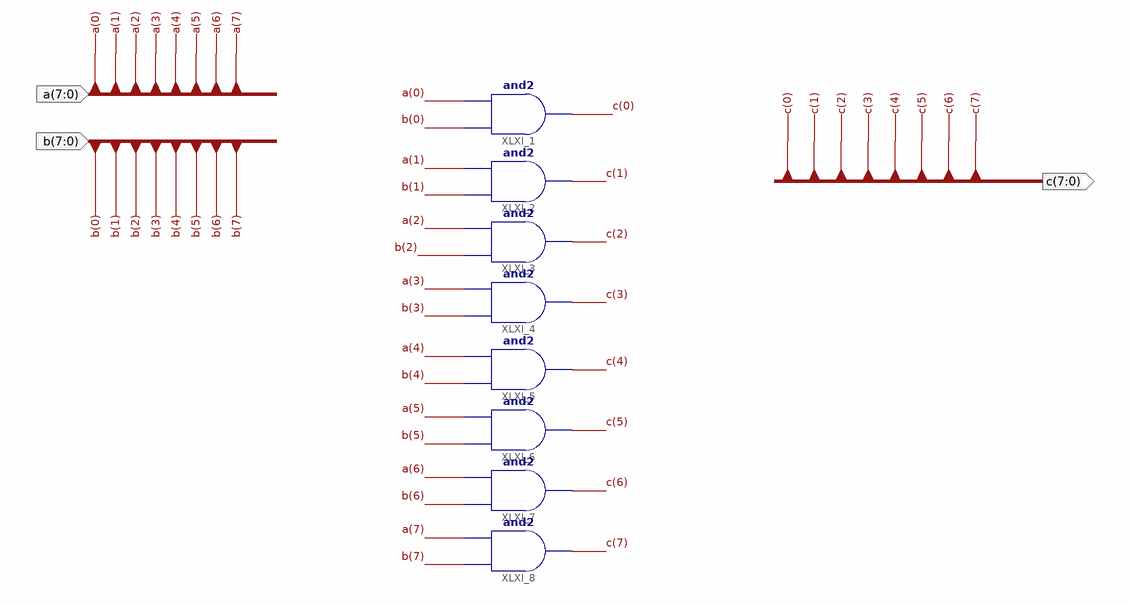
[diagram p0: schematic sheet 1]
// Xilinx ISE schematic Bitwise_And.sch (spartan6) as structural Verilog: 8 symbols, 3 ports
module Bitwise_And (
  input  [7:0] a,
  input  [7:0] b,
  output [7:0] c
);

  and XLXI_1 (c[0], b[0], a[0]);
  and XLXI_2 (c[1], b[1], a[1]);
  and XLXI_3 (c[2], b[2], a[2]);
  and XLXI_4 (c[3], b[3], a[3]);
  and XLXI_5 (c[4], b[4], a[4]);
  and XLXI_6 (c[5], b[5], a[5]);
  and XLXI_7 (c[6], b[6], a[6]);
  and XLXI_8 (c[7], b[7], a[7]);
endmodule
